# Altium schematic sheet Power.SchDoc
size A4; SheetNumber: 6; SheetTotal: 6
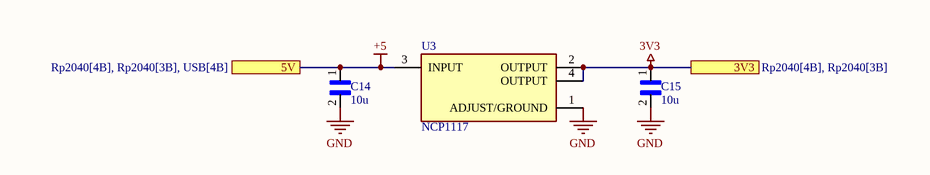
[diagram p0: Power.SchDoc]

## Parts
C14  10u  [SMD Capacator]
C15  10u  [SMD Capacator]
U3  NCP1117  [NCP1117]

## Ports
3V3 (see Rp2040[4B], Rp2040[3B]), 5V (see Rp2040[4B], Rp2040[3B], USB[4B])

## Nets
3V3: C15.1 U3.2(OUTPUT) U3.4(OUTPUT) ; port 3V3
+5: C14.1 U3.3(INPUT) ; port 5V
GND: C14.2 C15.2 U3.1(ADJUST/GROUND)

## Library data of the parts
C14 C15 = SMD Capacator